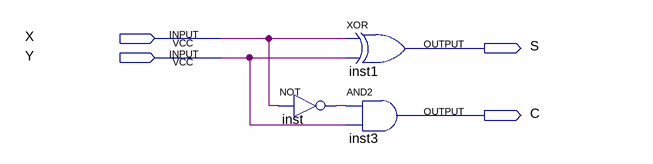
[diagram p0: schematic sheet]
// Quartus schematic MeioSubtrator.bdf as structural Verilog: 3 symbols, 4 pins
module MeioSubtrator (
  input  X,
  input  Y,
  output S,
  output C
);

  wire inst_out;

  not inst (inst_out, X);
  xor inst1 (S, X, Y);
  and inst3 (C, inst_out, Y);
endmodule
